# Altium schematic sheet 0_Architecture.SchDoc
size A4; Organization: UFSC
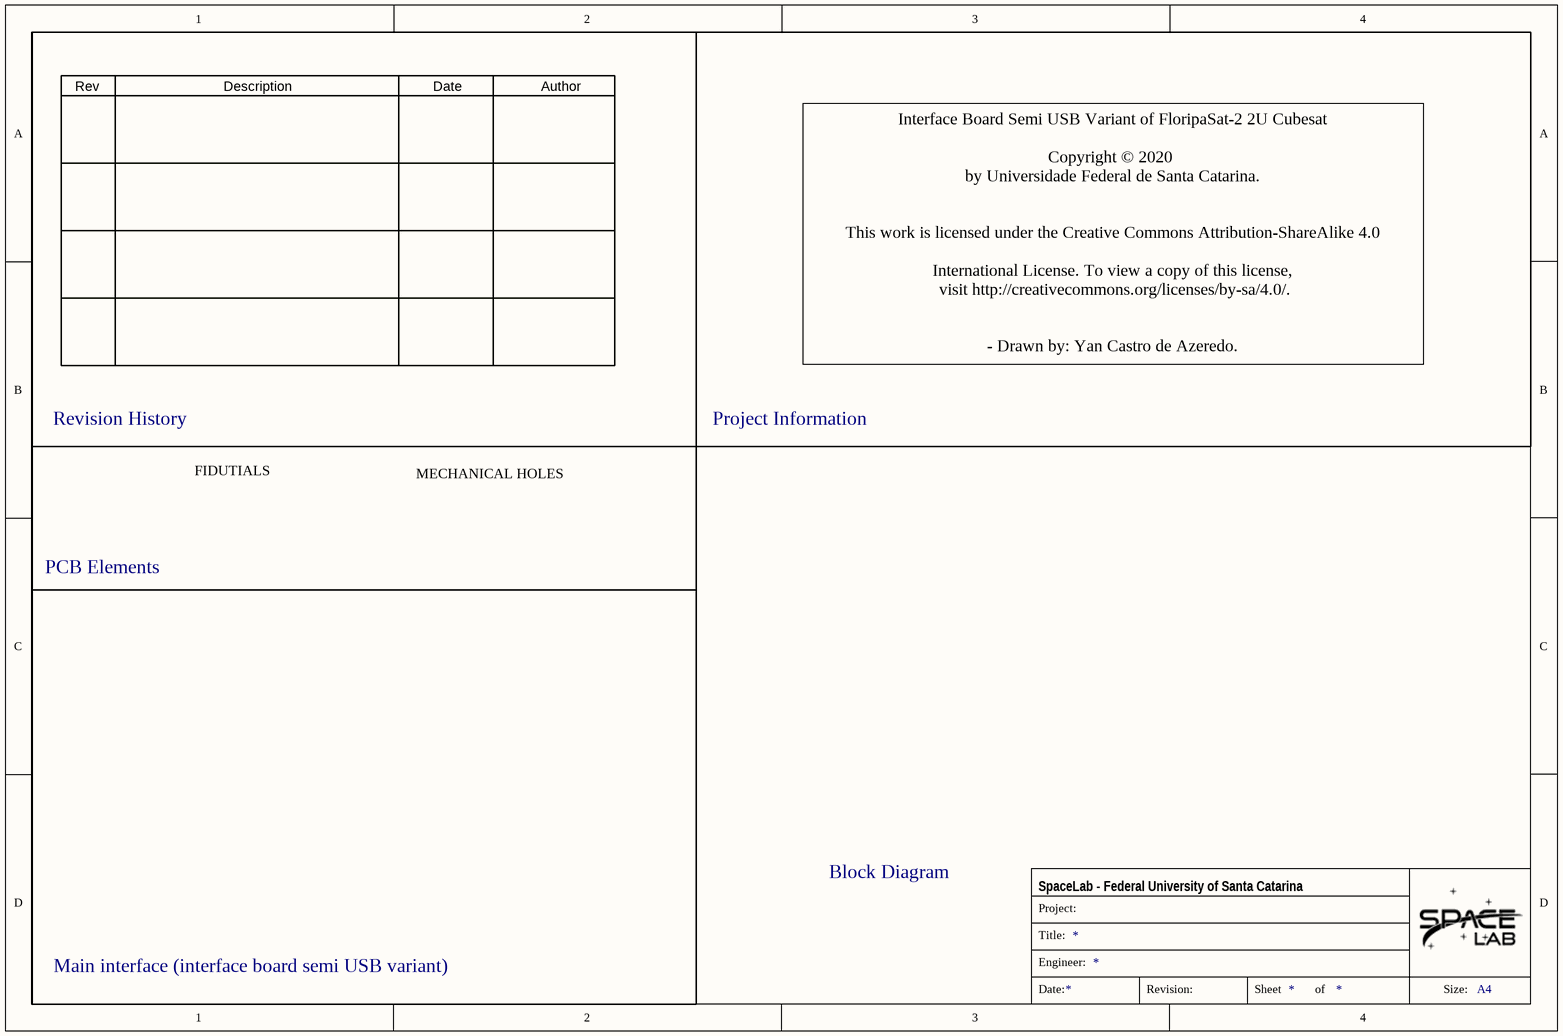
[diagram p0: 0_Architecture.SchDoc]

## Notes on the sheet
- Rev
- Description
- Date
- Author
- Interface Board Semi USB Variant of FloripaSat-2 2U Cubesat
  Copyright © 2020
  by Universidade Federal de Santa Catarina.
  This work is licensed under the Creative Commons Attribution-ShareAlike 4.0
  International License. To view a copy of this license,
  visit http://creativecommons.org/licenses/by-sa/4.0/.
  - Drawn by: Yan Castro de Azeredo.
  - Reviewers:
  - Support:
- Revision History
- Project Information
- FIDUTIALS
- MECHANICAL HOLES
- PCB Elements
- Block Diagram
- Main interface (interface board semi USB variant)
- Project:
- SpaceLab - Federal University of Santa Catarina
- Title:
- Engineer:
- Date:
- Revision:
- Sheet
- of
- Size:
- A4